# Altium schematic sheet Ldo.+6V5.+5V4.SchDoc
size A4
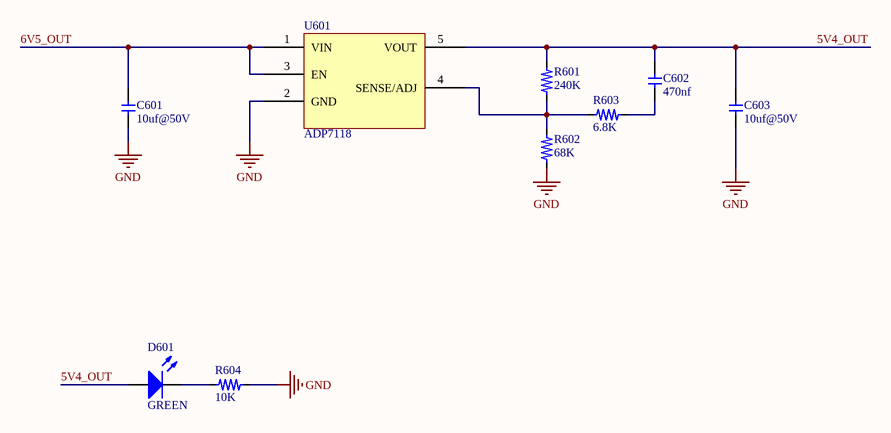
[diagram p0: Ldo.+6V5.+5V4.SchDoc]

## Parts
C601  value 10uf@50V  [C1210]  (hidden comment: Cap)
C602  value 470nf  [C0603]  (hidden comment: Cap)
C603  value 10uf@50V  [C1210]  (hidden comment: Cap)
D601  value GREEN  [LED0603]  (hidden comment: LED)
R601  value 240K  [R0603]  (hidden comment: Res)
R602  value 68K  [R0603]  (hidden comment: Res)
R603  value 6.8K  [R0603]  (hidden comment: Res)
R604  value 10K  [R0603]  (hidden comment: Res)
U601  ADP7118  [ADP7118-TSOT5]

## Nets
GND: C601.1 C603.1 R602.1 R604.1 U601.2(GND)
5V4_OUT: C602.1 C603.2 D601.1(A) R601.2 U601.5(VOUT)
6V5_OUT: C601.2 U601.1(VIN) U601.3(EN)
NetC602_2: C602.2 R603.1
NetD601_2: D601.2(K) R604.2
NetR601_1: R601.1 R602.2 R603.2 U601.4(SENSE/ADJ)

## Library data of the parts
R601-R604 = Res: 电阻
U601 = ADP7118AUJ: 20 V, 200 mA, Low Noise,CMOS LDO Linear Regulator.